# EAGLE schematic 120VAC (EAGLE 6.4)
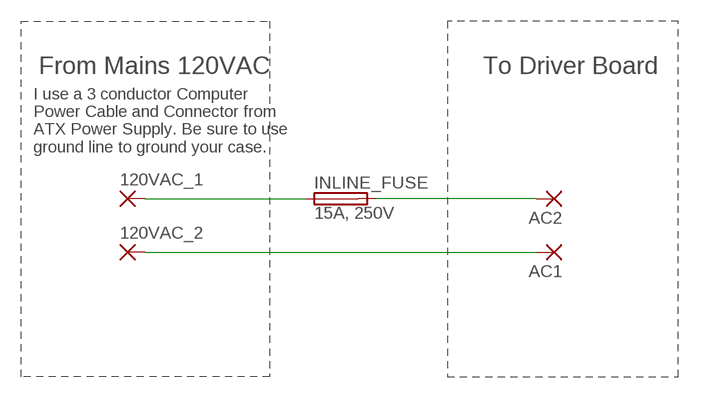
[diagram p0: schematic, sheet 1]

## Parts
120VAC_1  1,6/0,9  [1,6/0,9]
120VAC_2  1,6/0,9  [1,6/0,9]
AC1  1,6/0,9  [1,6/0,9]
AC2  1,6/0,9  [1,6/0,9]
INLINE_FUSE  15A, 250V  SH25  [SH25]

## Nets
N$1: AC2.1(P) INLINE_FUSE.2
N$2: 120VAC_1.1(P) INLINE_FUSE.1
N$3: 120VAC_2.1(P) AC1.1(P)

## Notes on the sheet
- From Mains 120VAC | To Driver Board
- I use a 3 conductor Computer 
  Power Cable and Connector from
  ATX Power Supply. Be sure to use
  ground line to ground your case.

## Library data of the parts
120VAC_1 120VAC_2 AC1 AC2 = wirepad:1,6/0,9: THROUGH-HOLE PAD
INLINE_FUSE = fuse:SH25: FUSE HOLDER grid 25 mm, OGN0031 8211, Schurter (Buerklin); MF: SCHURTER; MPN: 0031.8211; OC_FARNELL: 1162741; OC_NEWARK: 96B9380